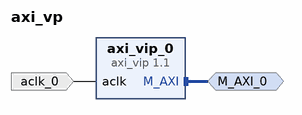
[diagram p0: block diagram of the top level]
# Vivado block design axi_vp, xc7z020clg400-1, Vivado 2020.1
create_bd_design axi_vp

create_bd_intf_port -mode Master -vlnv xilinx.com:interface:aximm_rtl:1.0 M_AXI_0
set_property -dict [list \
  CONFIG.DATA_WIDTH 32 \
  CONFIG.PROTOCOL AXI4 \
  CONFIG.ADDR_WIDTH 32 \
  CONFIG.NUM_READ_OUTSTANDING 2 \
  CONFIG.NUM_WRITE_OUTSTANDING 2 \
] [get_bd_intf_ports M_AXI_0]
create_bd_port -dir I -type clk aclk_0

create_bd_cell -type ip -vlnv xilinx.com:ip:axi_vip:1.1 axi_vip_0
set_property -dict [list \
  CONFIG.ADDR_WIDTH 12 \
  CONFIG.DATA_WIDTH 32 \
  CONFIG.HAS_ARESETN 0 \
  CONFIG.HAS_BRESP 1 \
  CONFIG.HAS_PROT 0 \
  CONFIG.HAS_RRESP 1 \
  CONFIG.HAS_WSTRB 0 \
  CONFIG.INTERFACE_MODE MASTER \
  CONFIG.PROTOCOL AXI4LITE \
  CONFIG.READ_WRITE_MODE READ_WRITE \
] [get_bd_cells axi_vip_0]

# ---- connections ----

connect_bd_intf_net [get_bd_intf_ports M_AXI_0] [get_bd_intf_pins axi_vip_0/M_AXI]
connect_bd_net -net aclk_0_1 [get_bd_ports aclk_0] [get_bd_pins axi_vip_0/aclk]

# ---- address map ----
assign_bd_address -offset 0x000 -range 4K -target_address_space [get_bd_addr_spaces axi_vip_0/Master_AXI] [get_bd_addr_segs M_AXI_0/Reg]

validate_bd_design
save_bd_design
